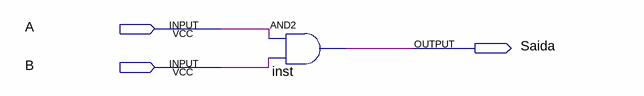
[diagram p0: schematic sheet]
// Quartus schematic Aula02.bdf as structural Verilog: 1 symbols, 3 pins
module Aula02 (
  input  A,
  input  B,
  output Saida
);

  and inst (Saida, A, B);
endmodule
